# Altium schematic sheet 01_MCU_Interface.SchDoc: Mainboard MCU
size A3; SheetNumber: 5; SheetTotal: 13
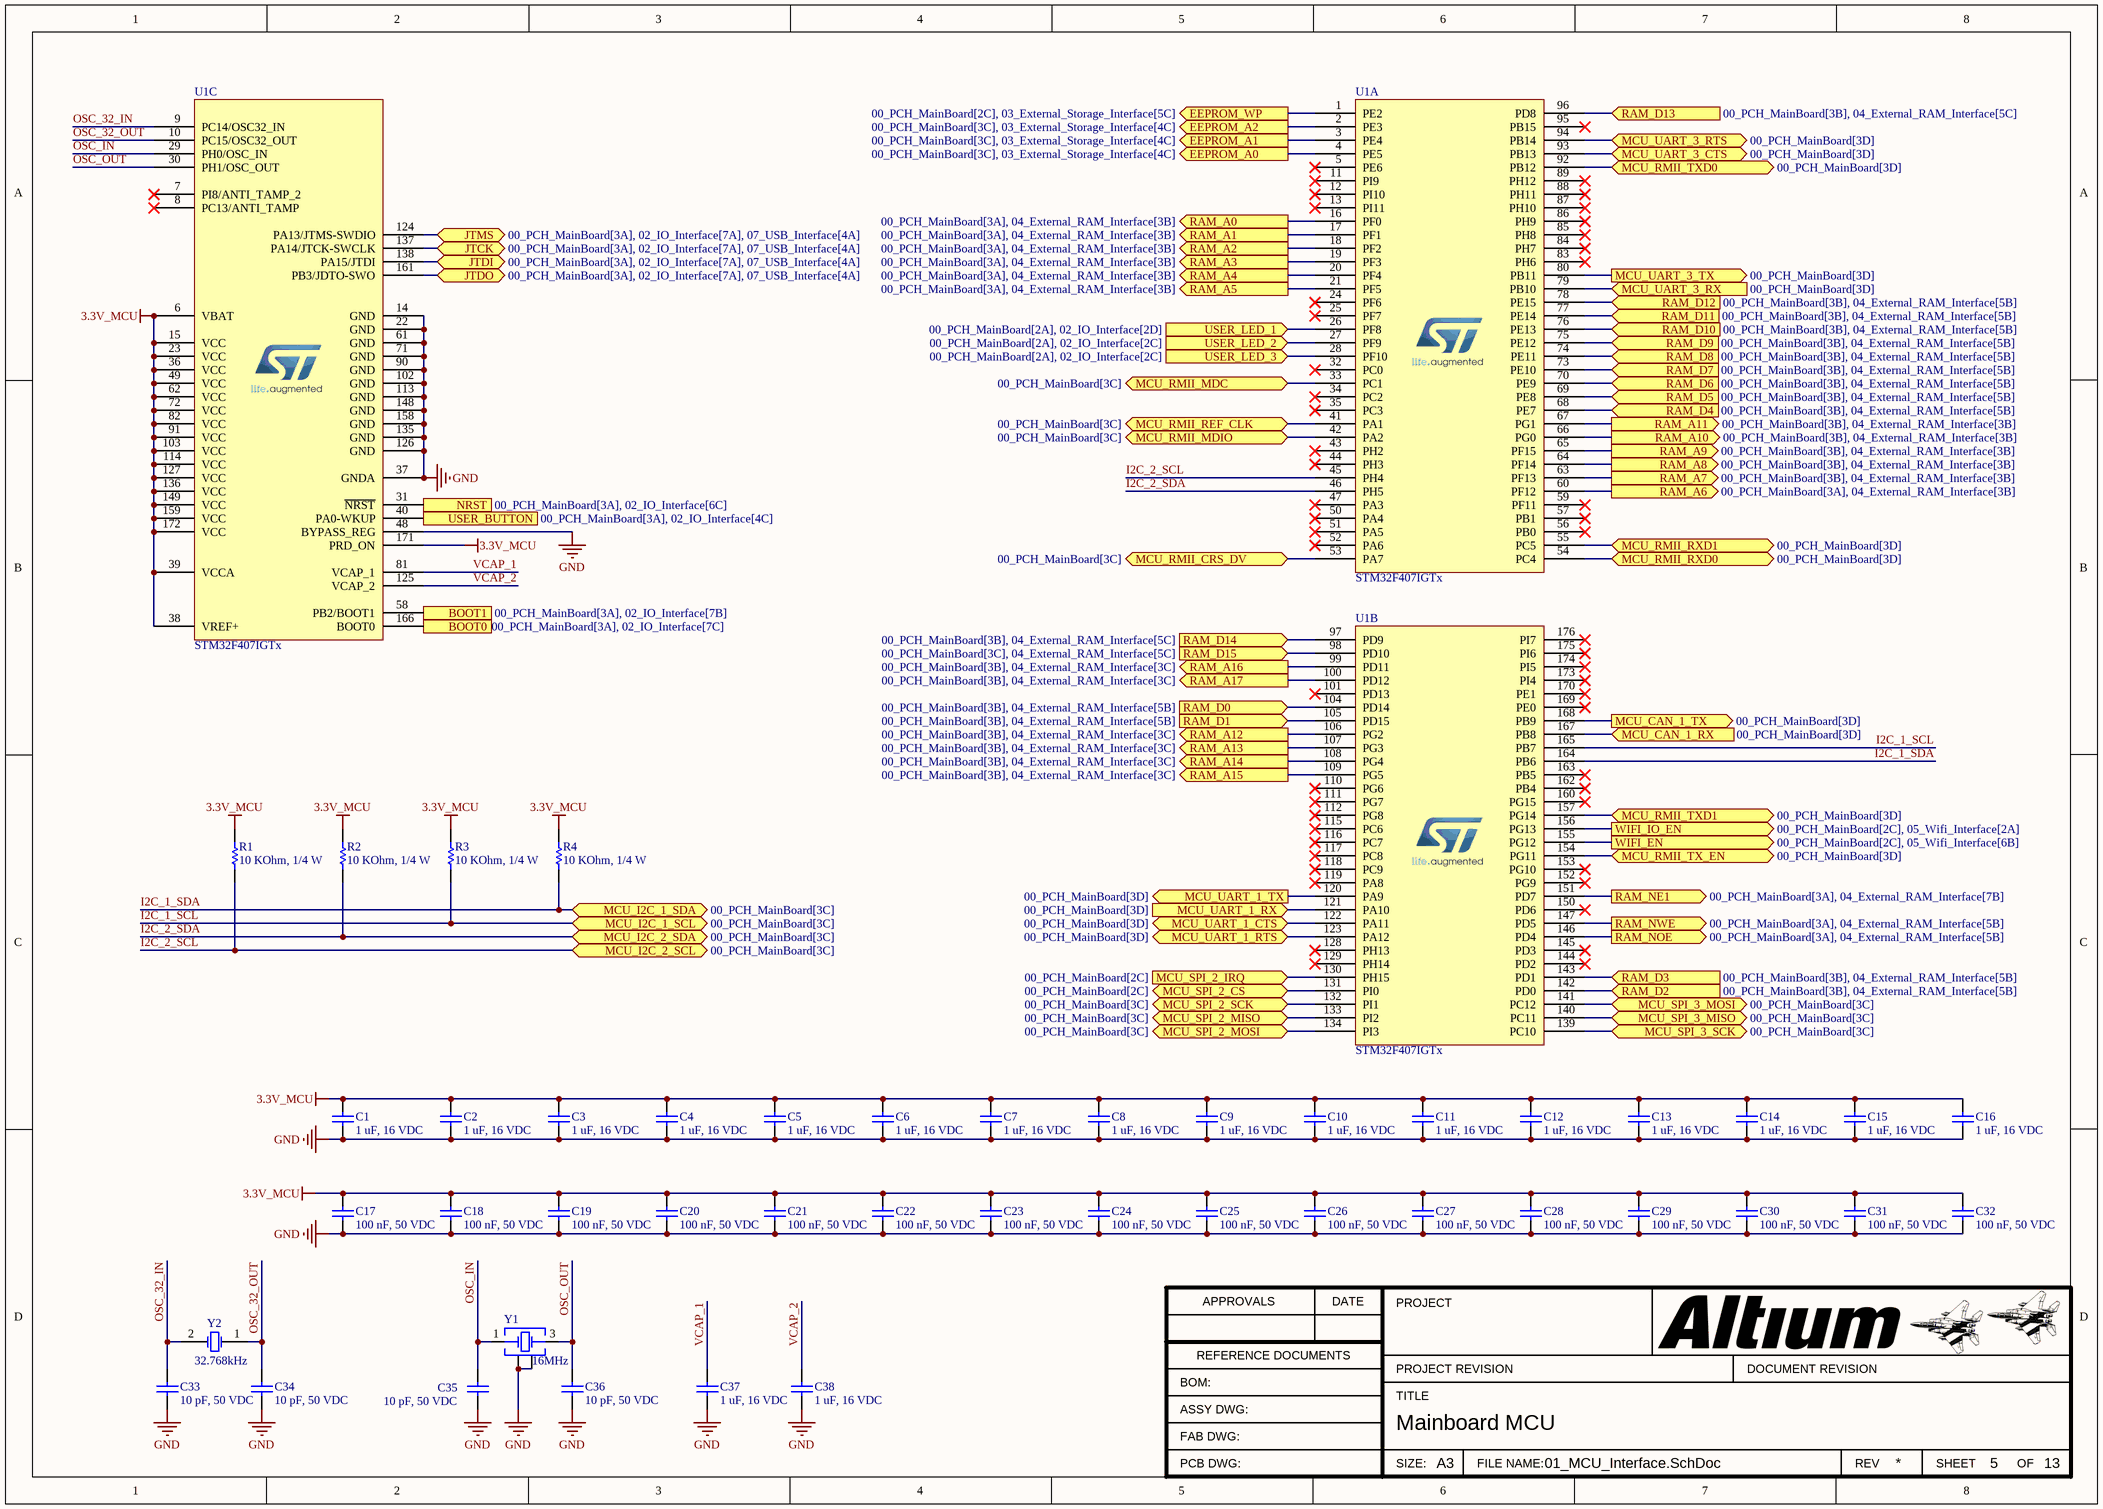
[diagram p0: 01_MCU_Interface.SchDoc]

## Parts
C1  1 uF, 16 VDC  [CAP_0603]
C2  1 uF, 16 VDC  [CAP_0603]
C3  1 uF, 16 VDC  [CAP_0603]
C4  1 uF, 16 VDC  [CAP_0603]
C5  1 uF, 16 VDC  [CAP_0603]
C6  1 uF, 16 VDC  [CAP_0603]
C7  1 uF, 16 VDC  [CAP_0603]
C8  1 uF, 16 VDC  [CAP_0603]
C9  1 uF, 16 VDC  [CAP_0603]
C10  1 uF, 16 VDC  [CAP_0603]
C11  1 uF, 16 VDC  [CAP_0603]
C12  1 uF, 16 VDC  [CAP_0603]
C13  1 uF, 16 VDC  [CAP_0603]
C14  1 uF, 16 VDC  [CAP_0603]
C15  1 uF, 16 VDC  [CAP_0603]
C16  1 uF, 16 VDC  [CAP_0603]
C17  100 nF, 50 VDC  [CAP_0603]
C18  100 nF, 50 VDC  [CAP_0603]
C19  100 nF, 50 VDC  [CAP_0603]
C20  100 nF, 50 VDC  [CAP_0603]
C21  100 nF, 50 VDC  [CAP_0603]
C22  100 nF, 50 VDC  [CAP_0603]
C23  100 nF, 50 VDC  [CAP_0603]
C24  100 nF, 50 VDC  [CAP_0603]
C25  100 nF, 50 VDC  [CAP_0603]
C26  100 nF, 50 VDC  [CAP_0603]
C27  100 nF, 50 VDC  [CAP_0603]
C28  100 nF, 50 VDC  [CAP_0603]
C29  100 nF, 50 VDC  [CAP_0603]
C30  100 nF, 50 VDC  [CAP_0603]
C31  100 nF, 50 VDC  [CAP_0603]
C32  100 nF, 50 VDC  [CAP_0603]
C33  10 pF, 50 VDC  [CAP_0603]
C34  10 pF, 50 VDC  [CAP_0603]
C35  10 pF, 50 VDC  [CAP_0603]
C36  10 pF, 50 VDC  [CAP_0603]
C37  1 uF, 16 VDC  [CAP_0603]
C38  1 uF, 16 VDC  [CAP_0603]
R1  10 KOhm, 1/4 W  [resistor_0603]
R2  10 KOhm, 1/4 W  [resistor_0603]
R3  10 KOhm, 1/4 W  [resistor_0603]
R4  10 KOhm, 1/4 W  [resistor_0603]
U1  STM32F407IGTx  [STM32F407IGTx]  (parts A,B,C of 3)
Y1  16MHz  [WE-XTAL_CFPX-180]
Y2  32.768kHz  [WE-XTAL_WATCH_830002995B]

## Ports
BOOT0 (in, see 00_PCH_MainBoard[3A], 02_IO_Interface[7C]), BOOT1 (in, see 00_PCH_MainBoard[3A], 02_IO_Interface[7B]), EEPROM_A0 (out, see 00_PCH_MainBoard[3C], 03_External_Storage_Interface[4C]), EEPROM_A1 (out, see 00_PCH_MainBoard[3C], 03_External_Storage_Interface[4C]), EEPROM_A2 (out, see 00_PCH_MainBoard[3C], 03_External_Storage_Interface[4C]), EEPROM_WP (out, see 00_PCH_MainBoard[2C], 03_External_Storage_Interface[5C]), JTCK (bidir, see 00_PCH_MainBoard[3A], 02_IO_Interface[7A], 07_USB_Interface[4A]), JTDI (bidir, see 00_PCH_MainBoard[3A], 02_IO_Interface[7A], 07_USB_Interface[4A]), JTDO (bidir, see 00_PCH_MainBoard[3A], 02_IO_Interface[7A], 07_USB_Interface[4A]), JTMS (bidir, see 00_PCH_MainBoard[3A], 02_IO_Interface[7A], 07_USB_Interface[4A]), MCU_CAN_1_RX (in, see 00_PCH_MainBoard[3D]), MCU_CAN_1_TX (out, see 00_PCH_MainBoard[3D]), MCU_I2C_1_SCL (bidir, see 00_PCH_MainBoard[3C]), MCU_I2C_1_SDA (bidir, see 00_PCH_MainBoard[3C]), MCU_I2C_2_SCL (bidir, see 00_PCH_MainBoard[3C]), MCU_I2C_2_SDA (bidir, see 00_PCH_MainBoard[3C]), MCU_RMII_CRS_DV (bidir, see 00_PCH_MainBoard[3C]), MCU_RMII_MDC (bidir, see 00_PCH_MainBoard[3C]), MCU_RMII_MDIO (bidir, see 00_PCH_MainBoard[3C]), MCU_RMII_REF_CLK (bidir, see 00_PCH_MainBoard[3C]), MCU_RMII_RXD0 (bidir, see 00_PCH_MainBoard[3D]), MCU_RMII_RXD1 (bidir, see 00_PCH_MainBoard[3D]), MCU_RMII_TX_EN (bidir, see 00_PCH_MainBoard[3D]), MCU_RMII_TXD0 (bidir, see 00_PCH_MainBoard[3D]), MCU_RMII_TXD1 (bidir, see 00_PCH_MainBoard[3D]), MCU_SPI_2_CS (bidir, see 00_PCH_MainBoard[2C]), MCU_SPI_2_IRQ (in, see 00_PCH_MainBoard[2C]), MCU_SPI_2_MISO (bidir, see 00_PCH_MainBoard[3C]), MCU_SPI_2_MOSI (bidir, see 00_PCH_MainBoard[3C]), MCU_SPI_2_SCK (bidir, see 00_PCH_MainBoard[3C]), MCU_SPI_3_MISO (bidir, see 00_PCH_MainBoard[3C]), MCU_SPI_3_MOSI (bidir, see 00_PCH_MainBoard[3C]), MCU_SPI_3_SCK (bidir, see 00_PCH_MainBoard[3C]), MCU_UART_1_CTS (bidir, see 00_PCH_MainBoard[3D]), MCU_UART_1_RTS (bidir, see 00_PCH_MainBoard[3D]), MCU_UART_1_RX (in, see 00_PCH_MainBoard[3D]), MCU_UART_1_TX (out, see 00_PCH_MainBoard[3D]), MCU_UART_3_CTS (bidir, see 00_PCH_MainBoard[3D]), MCU_UART_3_RTS (bidir, see 00_PCH_MainBoard[3D]), MCU_UART_3_RX (in, see 00_PCH_MainBoard[3D]), MCU_UART_3_TX (out, see 00_PCH_MainBoard[3D]), NRST (in, see 00_PCH_MainBoard[3A], 02_IO_Interface[6C]), RAM_A0 (out, see 00_PCH_MainBoard[3A], 04_External_RAM_Interface[3B]), RAM_A1 (out, see 00_PCH_MainBoard[3A], 04_External_RAM_Interface[3B]), RAM_A2 (out, see 00_PCH_MainBoard[3A], 04_External_RAM_Interface[3B]), RAM_A3 (out, see 00_PCH_MainBoard[3A], 04_External_RAM_Interface[3B]), RAM_A4 (out, see 00_PCH_MainBoard[3A], 04_External_RAM_Interface[3B]), RAM_A5 (out, see 00_PCH_MainBoard[3A], 04_External_RAM_Interface[3B]), RAM_A6 (out, see 00_PCH_MainBoard[3A], 04_External_RAM_Interface[3B]), RAM_A7 (out, see 00_PCH_MainBoard[3B], 04_External_RAM_Interface[3B]), RAM_A8 (out, see 00_PCH_MainBoard[3B], 04_External_RAM_Interface[3B]), RAM_A9 (out, see 00_PCH_MainBoard[3B], 04_External_RAM_Interface[3B]), RAM_A10 (out, see 00_PCH_MainBoard[3B], 04_External_RAM_Interface[3B]), RAM_A11 (out, see 00_PCH_MainBoard[3B], 04_External_RAM_Interface[3B]), RAM_A12 (out, see 00_PCH_MainBoard[3B], 04_External_RAM_Interface[3C]), RAM_A13 (out, see 00_PCH_MainBoard[3B], 04_External_RAM_Interface[3C]), RAM_A14 (out, see 00_PCH_MainBoard[3B], 04_External_RAM_Interface[3C]), RAM_A15 (out, see 00_PCH_MainBoard[3B], 04_External_RAM_Interface[3C]), RAM_A16 (out, see 00_PCH_MainBoard[3B], 04_External_RAM_Interface[3C]), RAM_A17 (out, see 00_PCH_MainBoard[3B], 04_External_RAM_Interface[3C]), RAM_D0 (in, see 00_PCH_MainBoard[3B], 04_External_RAM_Interface[5B]), RAM_D1 (in, see 00_PCH_MainBoard[3B], 04_External_RAM_Interface[5B]), RAM_D2 (in, see 00_PCH_MainBoard[3B], 04_External_RAM_Interface[5B]), RAM_D3 (in, see 00_PCH_MainBoard[3B], 04_External_RAM_Interface[5B]), RAM_D4 (in, see 00_PCH_MainBoard[3B], 04_External_RAM_Interface[5B]), RAM_D5 (in, see 00_PCH_MainBoard[3B], 04_External_RAM_Interface[5B]), RAM_D6 (in, see 00_PCH_MainBoard[3B], 04_External_RAM_Interface[5B]), RAM_D7 (in, see 00_PCH_MainBoard[3B], 04_External_RAM_Interface[5B]), RAM_D8 (in, see 00_PCH_MainBoard[3B], 04_External_RAM_Interface[5B]), RAM_D9 (in, see 00_PCH_MainBoard[3B], 04_External_RAM_Interface[5B]), RAM_D10 (in, see 00_PCH_MainBoard[3B], 04_External_RAM_Interface[5B]), RAM_D11 (in, see 00_PCH_MainBoard[3B], 04_External_RAM_Interface[5B]), RAM_D12 (in, see 00_PCH_MainBoard[3B], 04_External_RAM_Interface[5B]), RAM_D13 (in, see 00_PCH_MainBoard[3B], 04_External_RAM_Interface[5C]), RAM_D14 (in, see 00_PCH_MainBoard[3B], 04_External_RAM_Interface[5C]), RAM_D15 (in, see 00_PCH_MainBoard[3C], 04_External_RAM_Interface[5C]), RAM_NE1 (out, see 00_PCH_MainBoard[3A], 04_External_RAM_Interface[7B]), RAM_NOE (out, see 00_PCH_MainBoard[3A], 04_External_RAM_Interface[5B]), RAM_NWE (out, see 00_PCH_MainBoard[3A], 04_External_RAM_Interface[5B]), USER_BUTTON (in, see 00_PCH_MainBoard[3A], 02_IO_Interface[4C]), USER_LED_1 (in, see 00_PCH_MainBoard[2A], 02_IO_Interface[2D]), USER_LED_2 (in, see 00_PCH_MainBoard[2A], 02_IO_Interface[2C]), USER_LED_3 (in, see 00_PCH_MainBoard[2A], 02_IO_Interface[2C]), WIFI_EN (out, see 00_PCH_MainBoard[2C], 05_Wifi_Interface[6B]), WIFI_IO_EN (out, see 00_PCH_MainBoard[2C], 05_Wifi_Interface[2A])

## Nets
3.3V_MCU: C1.2 C2.2 C3.2 C4.2 C5.2 C6.2 C7.2 C8.2 C9.2 C10.2 C11.2 C12.2 C13.2 C14.2 C15.2 C16.2 C17.2 C18.2 C19.2 C20.2 C21.2 C22.2 C23.2 C24.2 C25.2 C26.2 C27.2 C28.2 C29.2 C30.2 C31.2 C32.2 R1.2 R2.2 R3.2 R4.2 U1.6(VBAT) U1.15(VCC) U1.23(VCC) U1.36(VCC) U1.38(VREF+) U1.39(VCCA) U1.49(VCC) U1.62(VCC) U1.72(VCC) U1.82(VCC) U1.91(VCC) U1.103(VCC) U1.114(VCC) U1.127(VCC) U1.136(VCC) U1.149(VCC) U1.159(VCC) U1.171(PRD_ON) U1.172(VCC)
GND: C1.1 C2.1 C3.1 C4.1 C5.1 C6.1 C7.1 C8.1 C9.1 C10.1 C11.1 C12.1 C13.1 C14.1 C15.1 C16.1 C17.1 C18.1 C19.1 C20.1 C21.1 C22.1 C23.1 C24.1 C25.1 C26.1 C27.1 C28.1 C29.1 C30.1 C31.1 C32.1 C33.1 C34.1 C35.1 C36.1 C37.1 C38.1 U1.14(GND) U1.22(GND) U1.37(GNDA) U1.48(BYPASS_REG) U1.61(GND) U1.71(GND) U1.90(GND) U1.102(GND) U1.113(GND) U1.126(GND) U1.135(GND) U1.148(GND) U1.158(GND) Y1.2(GND) Y1.4(GND)
BOOT0: U1.166(BOOT0) ; port BOOT0
BOOT1: U1.58(PB2/BOOT1) ; port BOOT1
EEPROM_A0: U1.4(PE5) ; port EEPROM_A0
EEPROM_A1: U1.3(PE4) ; port EEPROM_A1
EEPROM_A2: U1.2(PE3) ; port EEPROM_A2
EEPROM_WP: U1.1(PE2) ; port EEPROM_WP
I2C_1_SCL: R3.1 U1.165(PB7) ; port MCU_I2C_1_SCL
I2C_1_SDA: R4.1 U1.164(PB6) ; port MCU_I2C_1_SDA
I2C_2_SCL: R1.1 U1.45(PH4) ; port MCU_I2C_2_SCL
I2C_2_SDA: R2.1 U1.46(PH5) ; port MCU_I2C_2_SDA
JTCK: U1.137(PA14/JTCK-SWCLK) ; port JTCK
JTDI: U1.138(PA15/JTDI) ; port JTDI
JTDO: U1.161(PB3/JDTO-SWO) ; port JTDO
JTMS: U1.124(PA13/JTMS-SWDIO) ; port JTMS
MCU_CAN_1_RX: U1.167(PB8) ; port MCU_CAN_1_RX
MCU_CAN_1_TX: U1.168(PB9) ; port MCU_CAN_1_TX
MCU_RMII_CRS_DV: U1.53(PA7) ; port MCU_RMII_CRS_DV
MCU_RMII_MDC: U1.33(PC1) ; port MCU_RMII_MDC
MCU_RMII_MDIO: U1.42(PA2) ; port MCU_RMII_MDIO
MCU_RMII_REF_CLK: U1.41(PA1) ; port MCU_RMII_REF_CLK
MCU_RMII_RXD0: U1.54(PC4) ; port MCU_RMII_RXD0
MCU_RMII_RXD1: U1.55(PC5) ; port MCU_RMII_RXD1
MCU_RMII_TX_EN: U1.154(PG11) ; port MCU_RMII_TX_EN
MCU_RMII_TXD0: U1.92(PB12) ; port MCU_RMII_TXD0
MCU_RMII_TXD1: U1.157(PG14) ; port MCU_RMII_TXD1
MCU_SPI_2_CS: U1.131(PI0) ; port MCU_SPI_2_CS
MCU_SPI_2_IRQ: U1.130(PH15) ; port MCU_SPI_2_IRQ
MCU_SPI_2_MISO: U1.133(PI2) ; port MCU_SPI_2_MISO
MCU_SPI_2_MOSI: U1.134(PI3) ; port MCU_SPI_2_MOSI
MCU_SPI_2_SCK: U1.132(PI1) ; port MCU_SPI_2_SCK
MCU_SPI_3_MISO: U1.140(PC11) ; port MCU_SPI_3_MISO
MCU_SPI_3_MOSI: U1.141(PC12) ; port MCU_SPI_3_MOSI
MCU_SPI_3_SCK: U1.139(PC10) ; port MCU_SPI_3_SCK
MCU_UART_1_CTS: U1.122(PA11) ; port MCU_UART_1_CTS
MCU_UART_1_RTS: U1.123(PA12) ; port MCU_UART_1_RTS
MCU_UART_1_RX: U1.121(PA10) ; port MCU_UART_1_RX
MCU_UART_1_TX: U1.120(PA9) ; port MCU_UART_1_TX
MCU_UART_3_CTS: U1.93(PB13) ; port MCU_UART_3_CTS
MCU_UART_3_RTS: U1.94(PB14) ; port MCU_UART_3_RTS
MCU_UART_3_RX: U1.79(PB10) ; port MCU_UART_3_RX
MCU_UART_3_TX: U1.80(PB11) ; port MCU_UART_3_TX
NRST: U1.31(~{NRST}) ; port NRST
OSC_32_IN: C33.2 U1.9(PC14/OSC32_IN) Y2.2(OSC2)
OSC_32_OUT: C34.2 U1.10(PC15/OSC32_OUT) Y2.1(OSC1)
OSC_IN: C35.2 U1.29(PH0/OSC_IN) Y1.1(Crystal)
OSC_OUT: C36.2 U1.30(PH1/OSC_OUT) Y1.3(Crystal)
RAM_A0: U1.16(PF0) ; port RAM_A0
RAM_A1: U1.17(PF1) ; port RAM_A1
RAM_A2: U1.18(PF2) ; port RAM_A2
RAM_A3: U1.19(PF3) ; port RAM_A3
RAM_A4: U1.20(PF4) ; port RAM_A4
RAM_A5: U1.21(PF5) ; port RAM_A5
RAM_A6: U1.60(PF12) ; port RAM_A6
RAM_A7: U1.63(PF13) ; port RAM_A7
RAM_A8: U1.64(PF14) ; port RAM_A8
RAM_A9: U1.65(PF15) ; port RAM_A9
RAM_A10: U1.66(PG0) ; port RAM_A10
RAM_A11: U1.67(PG1) ; port RAM_A11
RAM_A12: U1.106(PG2) ; port RAM_A12
RAM_A13: U1.107(PG3) ; port RAM_A13
RAM_A14: U1.108(PG4) ; port RAM_A14
RAM_A15: U1.109(PG5) ; port RAM_A15
RAM_A16: U1.99(PD11) ; port RAM_A16
RAM_A17: U1.100(PD12) ; port RAM_A17
RAM_D0: U1.104(PD14) ; port RAM_D0
RAM_D1: U1.105(PD15) ; port RAM_D1
RAM_D2: U1.142(PD0) ; port RAM_D2
RAM_D3: U1.143(PD1) ; port RAM_D3
RAM_D4: U1.68(PE7) ; port RAM_D4
RAM_D5: U1.69(PE8) ; port RAM_D5
RAM_D6: U1.70(PE9) ; port RAM_D6
RAM_D7: U1.73(PE10) ; port RAM_D7
RAM_D8: U1.74(PE11) ; port RAM_D8
RAM_D9: U1.75(PE12) ; port RAM_D9
RAM_D10: U1.76(PE13) ; port RAM_D10
RAM_D11: U1.77(PE14) ; port RAM_D11
RAM_D12: U1.78(PE15) ; port RAM_D12
RAM_D13: U1.96(PD8) ; port RAM_D13
RAM_D14: U1.97(PD9) ; port RAM_D14
RAM_D15: U1.98(PD10) ; port RAM_D15
RAM_NE1: U1.151(PD7) ; port RAM_NE1
RAM_NOE: U1.146(PD4) ; port RAM_NOE
RAM_NWE: U1.147(PD5) ; port RAM_NWE
USER_BUTTON: U1.40(PA0-WKUP) ; port USER_BUTTON
USER_LED_1: U1.26(PF8) ; port USER_LED_1
USER_LED_2: U1.27(PF9) ; port USER_LED_2
USER_LED_3: U1.28(PF10) ; port USER_LED_3
VCAP_1: C37.2 U1.81(VCAP_1)
VCAP_2: C38.2 U1.125(VCAP_2)
WIFI_EN: U1.155(PG12) ; port WIFI_EN
WIFI_IO_EN: U1.156(PG13) ; port WIFI_IO_EN

Not connected (* = marked no-connect by the designer): U1 5(PE6)* 7(PI8/ANTI_TAMP_2)* 8(PC13/ANTI_TAMP)* 11(PI9)* 12(PI10)* 13(PI11)* 24(PF6)* 25(PF7)* 32(PC0)* 34(PC2)* 35(PC3)* 43(PH2)* 44(PH3)* 47(PA3)* 50(PA4)* 51(PA5)* 52(PA6)* 56(PB0)* 57(PB1)* 59(PF11)* 83(PH6)* 84(PH7)* 85(PH8)* 86(PH9)* 87(PH10)* 88(PH11)* 89(PH12)* 95(PB15)* 101(PD13)* 110(PG6)* 111(PG7)* 112(PG8)* 115(PC6)* 116(PC7)* 117(PC8)* 118(PC9)* 119(PA8)* 128(PH13)* 129(PH14)* 144(PD2)* 145(PD3)* 150(PD6)* 152(PG9)* 153(PG10)* 160(PG15)* 162(PB4)* 163(PB5)* 169(PE0)* 170(PE1)* 173(PI4)* 174(PI5)* 175(PI6)* 176(PI7)*

## Notes on the sheet
- APPROVALS
- DATE
- PROJECT
- BOM:
- REFERENCE DOCUMENTS
- TITLE
- PROJECT REVISION
- DOCUMENT REVISION
- ASSY DWG:
- FAB DWG:
- PCB DWG:
- SIZE:
- A3
- FILE NAME:
- REV
- SHEET
- OF

## Library data of the parts
C1-C16 C37 C38 = 0106031051016: CAP, size 0603, 1 uF, 16 VDC; Manufacture Name: Samsung Electro-Mechanics; Manufacture SN: CL10B105KO8NNWC; Capacitance: 1 uF; Tolerance: +/-10%; Voltage Rating DC: 16 VDC; ComponentLink2Description: Datasheet; ComponentLink2URL: https://www.mouser.vn/datasheet/2/585/Samsung_MLCC_1837944-1929650.pdf; Operating Temperature: -55 to +125degC; Packaging: Tape and Reel; Mounting Technology: SMT; Size: 0603; Supplier 1 Name: Mouser; Supplier 1 SN: 187-CL10B105KO8NNWC; Supplier 1 URL: https://www.mouser.vn/ProductDetail/Samsung-Electro-Mechanics/CL10B105KO8NNWC?qs=81r%252BiQLm7BT%252BXtc72qn1ug%3D%3D&utm_source=mouser-refine-download&utm_medium=file&utm_campaign=CL10B105KO8NNWC&utm_content=Samsung-Electro-Mechanics; Supplier 2 Name: Digi-Key; Supplier 2 SN: 1276-CL10B105KO8NNWCTR-ND; Supplier 2 URL: https://www.digikey.com/en/products/detail/samsung-electro-mechanics/cl10b105ko8nnwc/16572783; Supplier 3 Name: thegioiic; Supplier 3 SN: N/A; Supplier 3 URL: https://www.thegioiic.com/tu-gom-0603-1uf-16v; Value: 1 uF, 16 VDC
C17-C32 = 0106031041050: CAP, size 0603, 100 nF, 50 VDC; Manufacture Name: TDK; Manufacture SN: CGA3E3X8R1H104K080AE; Capacitance: 100 nF; Tolerance: +/-10%; Voltage Rating DC: 50 VDC; ComponentLink2Description: Datasheet; ComponentLink2URL: https://product.tdk.com/system/files/dam/doc/product/capacitor/ceramic/mlcc/catalog/mlcc_automotive_soft_en.pdf?ref_disty=mouser; Operating Temperature: -55 to +125degC; Packaging: Tape and Reel; Mounting Technology: SMT; Size: 0603; Supplier 1 Name: Mouser; Supplier 1 SN: 810-CGA3E3X8R1H104KA; Supplier 1 URL: https://www.mouser.com/ProductDetail/TDK/CGA3E3X8R1H104K080AE?qs=nQSIdc08i%252Bd8g3IRRgU2bw%3D%3D&utm_source=mouser-refine-download&utm_medium=file&utm_campaign=CGA3E3X8R1H104K080AE&utm_content=TDK; Supplier 2 Name: Digi-Key; Supplier 2 SN: 445-173697-2-ND; Supplier 2 URL: https://www.digikey.com/en/products/detail/tdk-corporation/cga3e3x8r1h104k080ae/5809262; Supplier 3 Name: thegioiic; Supplier 3 SN: N/A; Supplier 3 URL: N/A; Value: 100 nF, 50 VDC
C33-C36 = 0106031000550: CAP, size 0603, 10 pF, 50 VDC; Manufacture Name: TDK; Manufacture SN: CGA3E2NP01H100D080AA; Capacitance: 10 pF; Tolerance: +/-5%; Voltage Rating DC: 50 VDC; ComponentLink2Description: Datasheet; ComponentLink2URL: https://product.tdk.com/system/files/dam/doc/product/capacitor/ceramic/mlcc/catalog/mlcc_automotive_hightemp_en.pdf?ref_disty=mouser; Operating Temperature: -55 to +125degC; Packaging: Tape and Reel; Mounting Technology: SMT; Size: 0603; Supplier 1 Name: Mouser; Supplier 1 SN: 810-CGA3E2NP01H100DA; Supplier 1 URL: https://www.mouser.com/ProductDetail/TDK/CGA3E2NP01H100D080AA?qs=xLDY6iXSiQYSDBjUp7bVxg%3D%3D&utm_source=mouser-refine-download&utm_medium=file&utm_campaign=CGA3E2NP01H100D080AA&utm_content=TDK; Supplier 2 Name: Digi-Key; Supplier 2 SN: 445-12387-2-ND; Supplier 2 URL: https://www.digikey.com/en/products/detail/tdk-corporation/cga3e2np01h100d080aa/3949623; Supplier 3 Name: thegioiic; Supplier 3 SN: N/A; Supplier 3 URL: N/A; Value: 10 pF, 50 VDC
R1-R4 = 0006031031: RES, size 0603, 10 KOhm, 1/4 W; Manufacture  Name: OEM; Resistance: 10 KOhm; Rated Power: 1/4 W; Resistance Tolerance: +/-1%; Size: 0603; Mounting Technology: SMT; Supplier 1 Name: Mouser; Supplier 1 SN: 755-ESR03EZPF1002; Supplier 2 Name: Digi-Key; Supplier 2 SN: RHM10KADTR-ND RHM10KADCT-ND RHM10KADDKR-ND; Supplier 1 URL: https://www.mouser.vn/ProductDetail/ROHM-Semiconductor/ESR03EZPF1002?qs=sGAEpiMZZMvdGkrng054t67Efho1F8r6CDeAsqwFse8%3D; Supplier 3 Name: thegioiic; Supplier 3 SN: N/A; Supplier 3 URL: N/A; Manufacture  SN: OEM; Value: 10 KOhm, 1/4 W; ComponentLink1Description: Datasheet link; ComponentLink1URL: https://fscdn.rohm.com/en/products/databook/datasheet/passive/resistor/chip_resistor/esr-e.pdf; ComponentLink2Description: Supplier 1 URL; ComponentLink2URL: N/A; ComponentLink3Description: Supplier 2 URL; ComponentLink3URL: https://www.digikey.com/en/products/detail/rohm-semiconductor/ESR03EZPF1002/1983429; ComponentLink4Description: Supplier 3 URL; ComponentLink4URL: N/A; Supplier 2 URL: https://www.digikey.com/en/products/detail/rohm-semiconductor/ESR03EZPF1002/1983429
U1 = STM32F407IGTx: ARM Microcontrollers - MCU ARM M4 1024 FLASH 168 Mhz 192kB SRAM; Manufacturer: STM; Pad count: 176; ComponentLink1Description: Datasheet; Manufacture SN: STM32F407IGTx; Part Number: STM32F407IGTx; Value: STM32F407IGTx; ComponentLink1URL: https://www.mouser.com/datasheet/2/389/stm32f405rg-1851084.pdf; Footprint name: LQFP176; ComponentLink2Description: Supplier 1 URL; ComponentLink2URL: https://www.mouser.com/ProductDetail/STMicroelectronics/STM32F407IGT6?qs=Z8%252BeY1k3TIKtCI1VFSVLrA%3D%3D; ComponentLink3Description: Supplier 2 URL; ComponentLink3URL: 497-11604-ND; ComponentLink4Description: Supplier 3 URL; ComponentLink4URL: N.A; Supplier 1 Name: Mouser; Supplier 1 SN: 511-STM32F407IGT6; Supplier 1 URL: https://www.mouser.com/ProductDetail/STMicroelectronics/STM32F407IGT6?qs=Z8%252BeY1k3TIKtCI1VFSVLrA%3D%3D; Supplier 2 Name: Digi-Key; Supplier 2 SN: 497-11604-ND; Supplier 2 URL: https://www.digikey.com/en/products/detail/stmicroelectronics/stm32f407igt6/2747118; Supplier 3 Name: thegioiic; Supplier 3 SN: N.A; Supplier 3 URL: N.A
Y1 = 073525166008: WE-XTAL Quartz Crystal, SMT, CFPX-180, 16MHz, +/-20ppm; Manufacturer Part Number: NX3225SA-16.000M-STD-CRS-2; Manufacturer: NDK; Frequency Stability: +/-50ppm; Load Capacitance: 8pF; Frequency Tolerance: +/-15ppm; ComponentLink2Description: Supplier 1 URL; ComponentLink2URL: https://www.mouser.com/ProductDetail/NDK/NX3225SA-16.000M-STD-CRS-2?qs=55YtniHzbhB2yRxaVPeqhg%3D%3D; Operating Temperature: -10 to +60degC; Size: CFPX-104/5032; Frequency: 16MHz; Mounting Technology: SMT; Supplier 3 Name: thegioiic; Supplier 3 SN: N/A; Supplier 3 URL: https://www.thegioiic.com/thach-anh-16mhz-5032-4-chan-smd; ComponentLink1Description: Datasheet link; ComponentLink1URL: https://www.mouser.com/datasheet/2/905/c_NX3225SA_e-1317523.pdf; ComponentLink3Description: Supplier 2 URL; ComponentLink3URL: https://www.digikey.com/en/products/detail/ndk-america-inc/NX3225SA-16-000M-STD-CRS-2/1788469; ComponentLink4Description: Supplier 3 URL; ComponentLink4URL: https://www.thegioiic.com/thach-anh-16mhz-5032-4-chan-smd; Supplier 1 Name: Mouser; Supplier 1 SN: 344-NX3225SA16MCRS2; Supplier 1 URL: https://www.mouser.com/ProductDetail/NDK/NX3225SA-16.000M-STD-CRS-2?qs=55YtniHzbhB2yRxaVPeqhg%3D%3D; Supplier 2 Name: Digi-Key; Supplier 2 SN: 644-1129-2-ND; Supplier 2 URL: https://www.digikey.com/en/products/detail/ndk-america-inc/NX3225SA-16-000M-STD-CRS-2/1788469; Value: 16MHz
Y2 = 070003323012: WE-XTAL Watch Crystal, THT, WATCH, 32.768kHz, +/-20ppm; Manufacturer Part Number: 830002995B; Manufacturer: Wurth Elektronik; Load Capacitance: 12.5pF; ComponentLink2Description: Supplier 1 URL; ComponentLink2URL: https://www.mouser.com/ProductDetail/Wurth-Elektronik/830002995B?qs=2WXlatMagcHCnw26vHVZcg%3D%3D; Operating Temperature: -40 to +85degC; Size: WATCH; Frequency Stability: -; Frequency: 32.768kHz; Frequency Tolerance: +/-20ppm; Mounting Technology: THT; Supplier 3 Name: thegioiic; Supplier 3 SN: N/A; Supplier 3 URL: https://www.thegioiic.com/thach-anh-32-768khz-3x8mm; ComponentLink1Description: Datasheet link; ComponentLink1URL: https://katalog.we-online.com/pbs/datasheet/830002995B.pdf; ComponentLink3Description: Supplier 2 URL; ComponentLink3URL: https://www.digikey.com/en/products/detail/w%C3%BCrth-elektronik/830002995b/13979343; ComponentLink4Description: Supplier 3 URL; ComponentLink4URL: https://www.thegioiic.com/thach-anh-32-768khz-3x8mm; Supplier 1 Name: Mouser; Supplier 1 SN: 710-830002995B; Supplier 1 URL: https://www.mouser.com/ProductDetail/Wurth-Elektronik/830002995B?qs=2WXlatMagcHCnw26vHVZcg%3D%3D; Supplier 2 Name: Digi-Key; Supplier 2 SN: 732-830002995B-ND; Supplier 2 URL: https://www.digikey.com/en/products/detail/w%C3%BCrth-elektronik/830002995b/13979343; Value: 32.768kHz